# EAGLE design interface-2-cart (EAGLE 9.4.2)
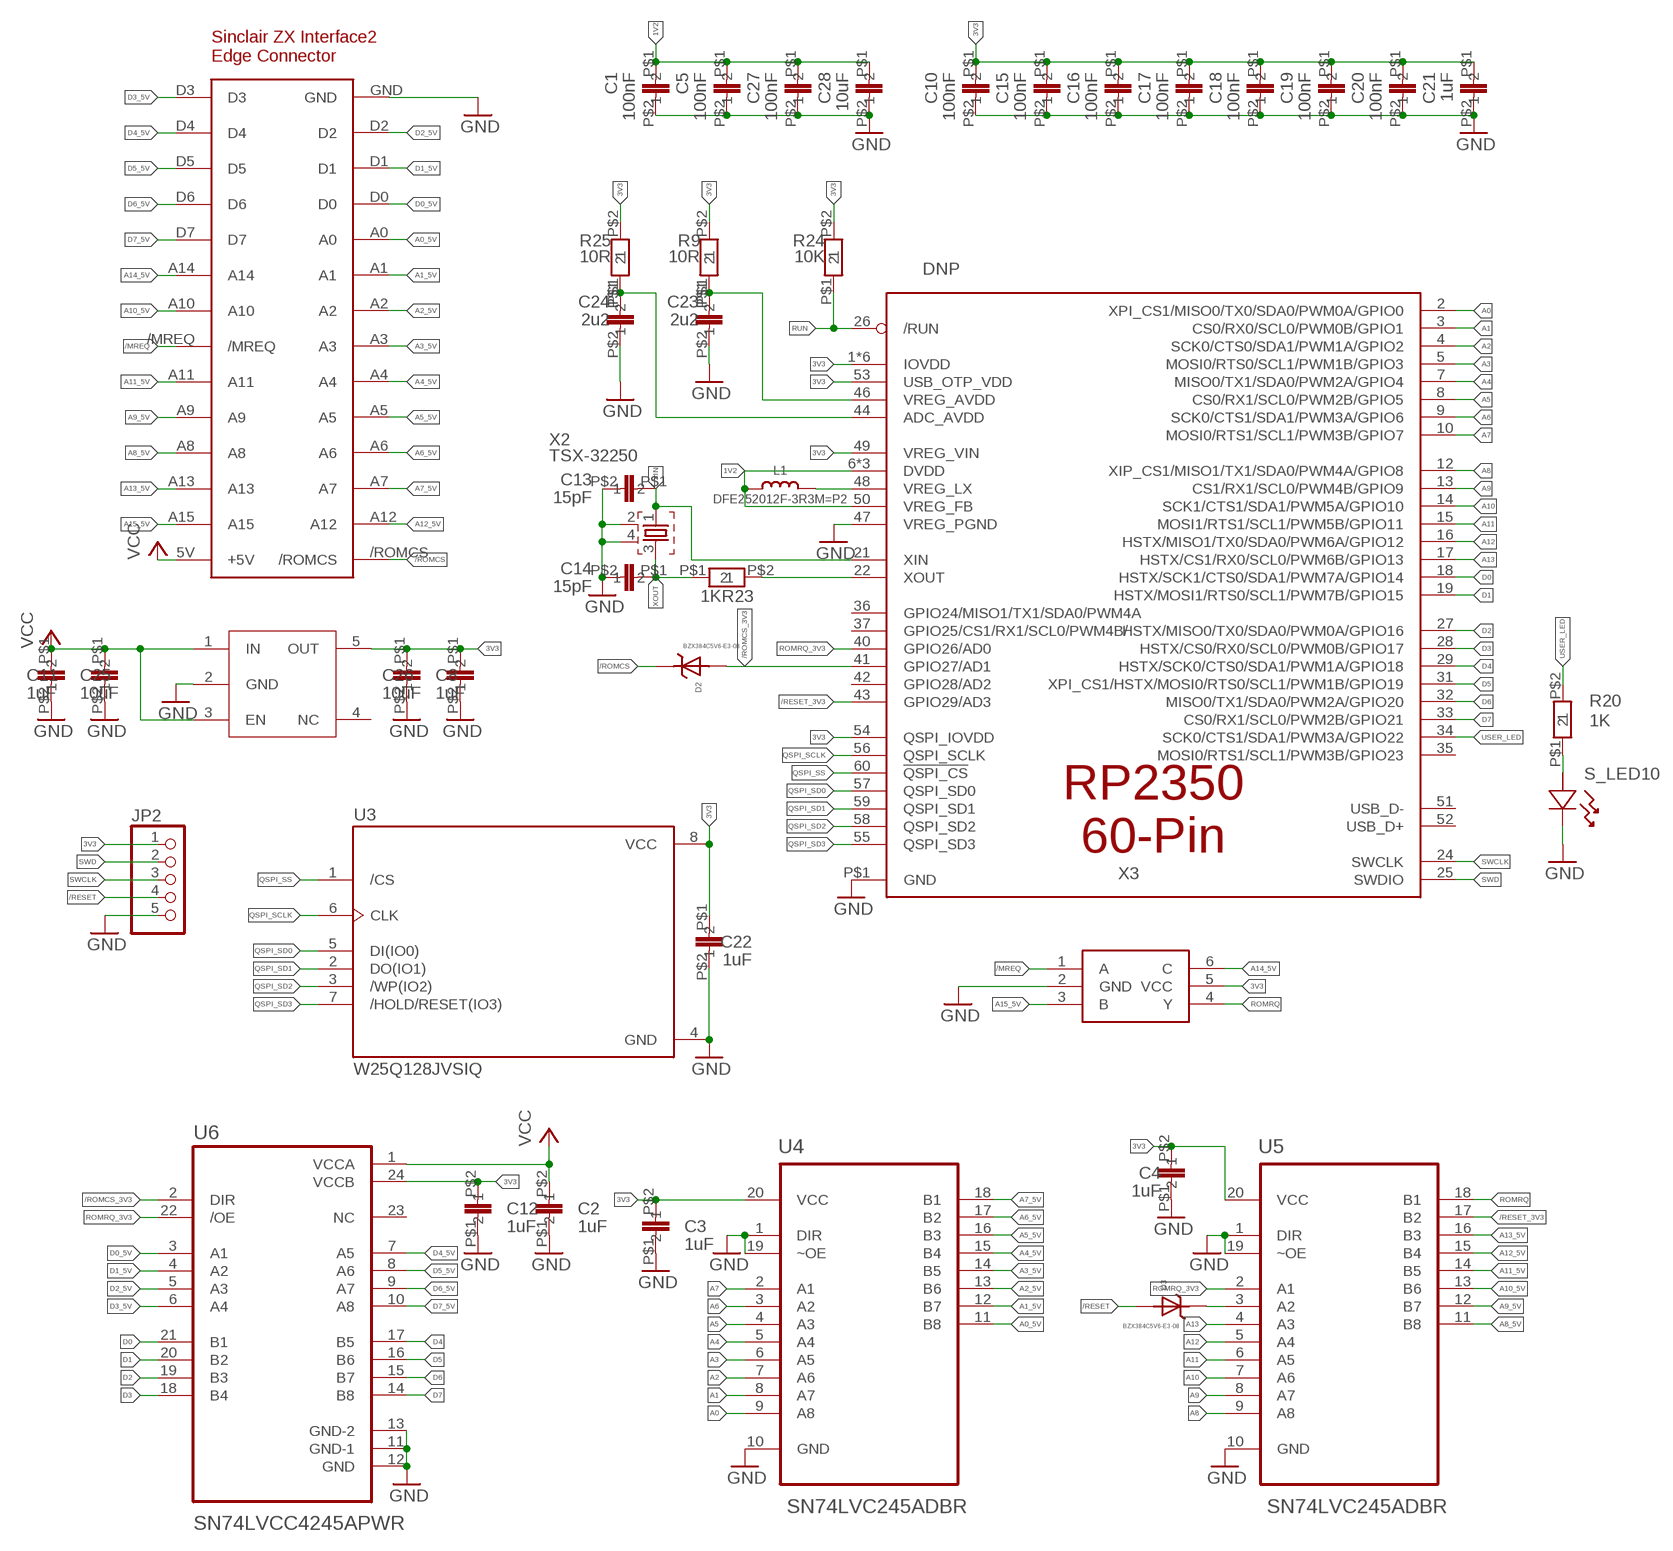
[diagram p0: schematic, sheet 1]

## Parts
3V3_REG2  3V3  NCP718BSN330T1G  [NCP718BSN330T1G]
C1  100nF  CAP-0402  [C0402]
C2  1uF  CAP-0402  [C0402]
C3  1uF  CAP-0402  [C0402]
C4  1uF  CAP-0402  [C0402]
C5  100nF  CAP-0402  [C0402]
C8  1uF  CAP-0402  [C0402]
C10  100nF  CAP-0402  [C0402]
C11  1uF  CAP-0402  [C0402]
C12  1uF  CAP-0402  [C0402]
C13  15pF  CAP-0402  [C0402]
C14  15pF  CAP-0402  [C0402]
C15  100nF  CAP-0402  [C0402]
C16  100nF  CAP-0402  [C0402]
C17  100nF  CAP-0402  [C0402]
C18  100nF  CAP-0402  [C0402]
C19  100nF  CAP-0402  [C0402]
C20  100nF  CAP-0402  [C0402]
C21  1uF  CAP-0402  [C0402]
C22  1uF  CAP-0402  [C0402]
C23  2u2  CAP-0402  [C0402]
C24  2u2  CAP-0402  [C0402]
C25  10uF  CAP-0402  [C0402]
C26  10uF  CAP-0402  [C0402]
C27  100nF  CAP-0402  [C0402]
C28  10uF  CAP-0402  [C0402]
D2  BZX384C5V6-E3-08  [SOD-323]
D3  BZX384C5V6-E3-08  [SOD-323]
JP2  PINHD-1X5  [1X05]
L1  DFE252012F-3R3M=P2  INDUCTOR  [INDUCTOR_1007]
R9  10R  RES-0402  [0402]
R20  1K  RES-0402  [0402]
R23  1K  RES-0402  [0402]
R24  10K  RES-0402  [0402]
R25  10R  RES-0402  [0402]
S_LED10  20mA  VLMW1500-GS08  [LED_VLMW15_VIS]
U3  W25Q128JVSIQ  [SOIC127P790X216-8N]
U4  SN74LVC245ADBR  [SOP65P780X200-20N]
U5  SN74LVC245ADBR  [SOP65P780X200-20N]
U6  SN74LVCC4245APWR  [SOP65P640X120-24N]
U$1  ZX_I2_ROM_EDGE_CONNECTOR  [ZX_I2_ROM_EDGE_CONNECTOR_V2]
U$2  74LVC1G332GW,125  [SOP65P210X110-6N]
X2  TSX-32250  [TSX-3225]
X3  DNP  RP2350_QFN60  [QFN60_7MM_REDUCEDEPAD]

## Nets
1V2: C1.P$1 C5.P$1 C27.P$1 C28.P$1 L1.P$1 X3.6(DVDD) X3.23(DVDD) X3.39(DVDD) X3.50(VREG_FB)
3V3: 3V3_REG2.5(OUT) C3.P$2 C4.P$2 C8.P$1 C10.P$1 C12.P$2 C15.P$1 C16.P$1 C17.P$1 C18.P$1 C19.P$1 C20.P$1 C21.P$1 C22.P$1 C26.P$1 JP2.1 R9.P$2 R24.P$2 R25.P$2 U3.8(VCC) U4.20(VCC) U5.20(VCC) U6.24(VCCB) U$2.5(VCC) X3.1(IOVDD) X3.11(IOVDD) X3.20(IOVDD) X3.30(IOVDD) X3.38(IOVDD) X3.45(IOVDD) X3.49(VREG_VIN) X3.53(USB_OTP_VDD) X3.54(QSPI_IOVDD)
/MREQ: U$1./MREQ U$2.1(A)
/RESET: D3.A JP2.4
/RESET_3V3: U5.17(B2) X3.43(GPIO29/AD3)
/ROMCS: D2.C U$1./ROMCS
/ROMCS_3V3: D2.A U6.2(DIR) X3.41(GPIO27/AD1)
A0: U4.9(A8) X3.2(XPI_CS1/MISO0/TX0/SDA0/PWM0A/GPIO0)
A0_5V: U4.11(B8) U$1.A0
A1: U4.8(A7) X3.3(CS0/RX0/SCL0/PWM0B/GPIO1)
A1_5V: U4.12(B7) U$1.A1
A2: U4.7(A6) X3.4(SCK0/CTS0/SDA1/PWM1A/GPIO2)
A2_5V: U4.13(B6) U$1.A2
A3: U4.6(A5) X3.5(MOSI0/RTS0/SCL1/PWM1B/GPIO3)
A3_5V: U4.14(B5) U$1.A3
A4: U4.5(A4) X3.7(MISO0/TX1/SDA0/PWM2A/GPIO4)
A4_5V: U4.15(B4) U$1.A4
A5: U4.4(A3) X3.8(CS0/RX1/SCL0/PWM2B/GPIO5)
A5_5V: U4.16(B3) U$1.A5
A6: U4.3(A2) X3.9(SCK0/CTS1/SDA1/PWM3A/GPIO6)
A6_5V: U4.17(B2) U$1.A6
A7: U4.2(A1) X3.10(MOSI0/RTS1/SCL1/PWM3B/GPIO7)
A7_5V: U4.18(B1) U$1.A7
A8: U5.9(A8) X3.12(XIP_CS1/MISO1/TX1/SDA0/PWM4A/GPIO8)
A8_5V: U5.11(B8) U$1.A8
A9: U5.8(A7) X3.13(CS1/RX1/SCL0/PWM4B/GPIO9)
A9_5V: U5.12(B7) U$1.A9
A10: U5.7(A6) X3.14(SCK1/CTS1/SDA1/PWM5A/GPIO10)
A10_5V: U5.13(B6) U$1.A10
A11: U5.6(A5) X3.15(MOSI1/RTS1/SCL1/PWM5B/GPIO11)
A11_5V: U5.14(B5) U$1.A11
A12: U5.5(A4) X3.16(HSTX/MISO1/TX0/SDA0/PWM6A/GPIO12)
A12_5V: U5.15(B4) U$1.A12
A13: U5.4(A3) X3.17(HSTX/CS1/RX0/SCL0/PWM6B/GPIO13)
A13_5V: U5.16(B3) U$1.A13
A14_5V: U$1.A14 U$2.6(C)
A15_5V: U$1.A15 U$2.3(B)
D0: U6.21(B1) X3.18(HSTX/SCK1/CTS0/SDA1/PWM7A/GPIO14)
D0_5V: U6.3(A1) U$1.D0
D1: U6.20(B2) X3.19(HSTX/MOSI1/RTS0/SCL1/PWM7B/GPIO15)
D1_5V: U6.4(A2) U$1.D1
D2: U6.19(B3) X3.27(HSTX/MISO0/TX0/SDA0/PWM0A/GPIO16)
D2_5V: U6.5(A3) U$1.D2
D3: U6.18(B4) X3.28(HSTX/CS0/RX0/SCL0/PWM0B/GPIO17)
D3_5V: U6.6(A4) U$1.D3
D4: U6.17(B5) X3.29(HSTX/SCK0/CTS0/SDA1/PWM1A/GPIO18)
D4_5V: U6.7(A5) U$1.D4
D5: U6.16(B6) X3.31(XPI_CS1/HSTX/MOSI0/RTS0/SCL1/PWM1B/GPIO19)
D5_5V: U6.8(A6) U$1.D5
D6: U6.15(B7) X3.32(MISO0/TX1/SDA0/PWM2A/GPIO20)
D6_5V: U6.9(A7) U$1.D6
D7: U6.14(B8) X3.33(CS0/RX1/SCL0/PWM2B/GPIO21)
D7_5V: U6.10(A8) U$1.D7
GND: 3V3_REG2.2(GND) C1.P$2 C2.P$1 C3.P$1 C4.P$1 C5.P$2 C8.P$2 C10.P$2 C11.P$2 C12.P$1 C13.P$2 C14.P$2 C15.P$2 C16.P$2 C17.P$2 C18.P$2 C19.P$2 C20.P$2 C21.P$2 C22.P$2 C23.P$2 C24.P$2 C25.P$2 C26.P$2 C27.P$2 C28.P$2 JP2.5 S_LED10.C U3.4(GND) U4.1(DIR) U4.10(GND) U4.19(~OE) U5.1(DIR) U5.10(GND) U5.19(~OE) U6.11(GND-1) U6.12(GND) U6.13(GND-2) U$1.GND U$2.2(GND) X2.2 X2.4 X3.47(VREG_PGND) X3.P$1(GND)
N$6: R20.P$1 S_LED10.A
N$9: D3.C U5.3(A2)
N$10: R23.P$2 X3.22(XOUT)
N$11: L1.P$2 X3.48(VREG_LX)
N$12: C23.P$1 R9.P$1 X3.46(VREG_AVDD)
N$13: C24.P$1 R25.P$1 X3.44(ADC_AVDD)
QSPI_SCLK: U3.6(CLK) X3.56(QSPI_SCLK)
QSPI_SD0: U3.5(DI(IO0)) X3.57(QSPI_SD0)
QSPI_SD1: U3.2(DO(IO1)) X3.59(QSPI_SD1)
QSPI_SD2: U3.3(/WP(IO2)) X3.58(QSPI_SD2)
QSPI_SD3: U3.7(/HOLD/RESET(IO3)) X3.55(QSPI_SD3)
QSPI_SS: U3.1(/CS) X3.60(!QSPI_CS)
ROMRQ: U5.18(B1) U$2.4(Y)
ROMRQ_3V3: U5.2(A1) U6.22(/OE) X3.40(GPIO26/AD0)
RUN: R24.P$1 X3.26(/RUN)
SWCLK: JP2.3 X3.24(SWCLK)
SWD: JP2.2 X3.25(SWDIO)
USER_LED: R20.P$2 X3.34(SCK0/CTS1/SDA1/PWM3A/GPIO22)
VCC: 3V3_REG2.1(IN) 3V3_REG2.3(EN) C2.P$2 C11.P$1 C25.P$1 U6.1(VCCA) U$1.5V(+5V)
XIN: C13.P$1 X2.1 X3.21(XIN)
XOUT: C14.P$1 R23.P$1 X2.3
Unconnected: 3V3_REG2.4(NC) U6.23(NC) X3.35(MOSI0/RTS1/SCL1/PWM3B/GPIO23) X3.36(GPIO24/MISO1/TX1/SDA0/PWM4A) X3.37(GPIO25/CS1/RX1/SCL0/PWM4B/) X3.42(GPIO28/AD2) X3.51(USB_D-) X3.52(USB_D+)

## Library data of the parts
3V3_REG2 = IC-packages_BIG-pack V1.0:NCP718BSN330T1G
C1-C5 C8 C10-C28 = res-small-footprint:CAP-0402
D2 D3 = BZX384C5V6-E3-08:BZX384C5V6-E3-08: VISHAY - Zener Single Diode, 5.6 V, 200 mW, SOD-323, 5 %, 2 Pins, 150 °C - SOD-323 Check availability <https://pricing.snapeda.com/parts/BZX384C5V6-E3-08/Vishay%20Semiconductors/view-part?ref=eda>; AVAILABILITY: In Stock; DESCRIPTION: Zener Diode Single 5.6V 5% 40Ohm 200mW 2-Pin SOD-323 T/R; MF: Vishay Semiconductors; MP: BZX384C5V6-E3-08; PACKAGE: None; PRICE: None; PURCHASE-URL: https://pricing.snapeda.com/search/part/BZX384C5V6-E3-08/?ref=eda
JP2 = pinhead:PINHD-1X5: PIN HEADER
L1 = microbuilder:INDUCTOR: Inductors 0603: 10nH Ceramic Inductor - microwire antenna/RF (Digikey: 712-1434-2-ND) 0805: 560nH Ceramic Inductor - RF (Digikey: 553-1047-1-ND) 270nH Ceramic Inductor - Q = 40@250MHz, +-5%, 1 Ohm DC Resistance (Digikey: 535-10506-2-ND) 1007 (2518 Metric) SMT: 10µH 10% 250mOhm 820mA 1007 Inductor (Digikey: 587-2189-1-ND) 22µH 10% 500mOhm 580mA 1007 Inductor (Digikey: 587-2190-1-ND) 47µH 10% 950mOhm 420mA 1007 Inductor (Digikey: 587-2191-1-ND) 47µH 5% 100mOhm 1A 1008 Inductor (Digikey: 732-1816-1-ND) 5.0x5.0mm (Taiyo Yuden NR5040 Series) 6.8µH 20% 2.3A 64mOhm Inductor (Digikey: 587-2374-2-ND) 5.0x5.0mm (TDK VLC5045 Series) 4.7µH 20% 3.3A 34mOhm Inductor (Digikey: 445-6526-1-ND) 6.8µH 20% 2.7A 46mOhm Inductor (Digikey: 445-6527-1-ND) 6.0x6.0mm (TDK VLC6045 Series) 4.7µH 20% 3.8A 27mOhm Inductor (Digikey: 445-6538-2-ND) 6.8µH 20% 3A 41mOhm Inductor (Digikey: 445-6540-1-ND) 6.2µH 30% 2.2A 45mOhm Inductor (Digikey: SRR5028-6R2YCT-ND) - Not TDK VLC6045 but footprint should match 6.0x6.0mm (TDK SLF6045 Series) 6.8uH 30% 2A 33mOhm Inductor (Digikey: 445-4572-1-ND, Mouser: 810-SLF645T6R8N2R0PF) 6.0x6.0mm (Sumida CDRH5D28 Series) 6.2uH 30% 1.8A 45mOhm Inductor (Digikey: 308-1542-1-ND) Taiyo Yuden NR3015T2R2M - 2.2uH 20% 1.5A (Digikey: 587-1648-2-ND, Mouser: 963-NR3015T2R2M) - Used with TI TPS62172 CoilCraft RFID Transponder Coil - MA5532-AE (For use with AS3935 Lightning Sensor) Taiyo Yuden NRH2412T2R2MNGH - 2.2uH 20% 1AA (Digikey: 587-3443-1-ND) - Used with TI LM3671 Vishay IHLP 1.0uH Molded Inductor - 24mOhm DCR, 5A, +/-20%, -55°C-125°C (Digikey: 541-1319-1-ND)
R9 R20 R23-R25 = res-small-footprint:RES-0402
S_LED10 = led-0402:VLMW1500-GS08; COPYRIGHT: Copyright (C) 2022 Ultra Librarian. All rights reserved.; MANUFACTURER_PART_NUMBER: VLMW1500-GS08; MFR_NAME: Vishay
U3 = W25Q128JVSIQ:W25Q128JVSIQ: Check availability <https://pricing.snapeda.com/parts/W25Q128JVSIQ/Winbond%20Electronics/view-part?ref=eda>; AVAILABILITY: In Stock; CHECK_PRICES: https://www.snapeda.com/parts/W25Q128JVSIQ/Winbond+Electronics/view-part/?ref=eda; DESCRIPTION: FLASH - NOR Memory IC 128Mb (16M x 8) SPI - Quad I/O, QPI, DTR 133 MHz 8-SOIC; MF: Winbond Electronics; MP: W25Q128JVSIQ; PACKAGE: SOIC-8 Winbond Electronics; PRICE: None; PURCHASE-URL: https://www.snapeda.com/api/url_track_click_mouser/?unipart_id=1054022&manufacturer=Winbond Electronics&part_name=W25Q128JVSIQ&search_term=None; SNAPEDA_LINK: https://www.snapeda.com/parts/W25Q128JVSIQ/Winbond+Electronics/view-part/?ref=snap
U4 U5 = SN74LVC245ADBR:SN74LVC245ADBR: Check availability <https://pricing.snapeda.com/parts/SN74LVC245ADBR/Texas%20Instruments/view-part?ref=eda>; AVAILABILITY: In Stock; CHECK_PRICES: https://www.snapeda.com/parts/SN74LVC245ADBR/Texas+Instruments/view-part/?ref=eda; DESCRIPTION: Octal Bus Transceiver With 3-State Outputs; MF: Texas Instruments; MP: SN74LVC245ADBR; PACKAGE: SSOP-20 Texas Instruments; PRICE: None; SNAPEDA_LINK: https://www.snapeda.com/parts/SN74LVC245ADBR/Texas+Instruments/view-part/?ref=snap
U6 = SN74LVCC4245APWR:SN74LVCC4245APWR: Check availability <https://pricing.snapeda.com/parts/SN74LVCC4245APWR/Texas%20Instruments/view-part?ref=eda>; AVAILABILITY: In Stock; CHECK_PRICES: https://www.snapeda.com/parts/SN74LVCC4245APWR/Texas+Instruments/view-part/?ref=eda; DESCRIPTION: Octal Bus Transceiver With Adjustable Output Voltage and 3-State Outputs; MF: Texas Instruments; MP: SN74LVCC4245APWR; PACKAGE: TSSOP-24 Texas Instruments; PRICE: None; SNAPEDA_LINK: https://www.snapeda.com/parts/SN74LVCC4245APWR/Texas+Instruments/view-part/?ref=snap
U$1 = zxs_i2_rom_edge_connector:ZX_I2_ROM_EDGE_CONNECTOR: Edge connector pro ROM modul pro Interface 2 počítače ZX Spectrum
U$2 = 74LVC1G332GW_125:74LVC1G332GW,125
X2 = TSX-3225:TSX-3225: MHz RANGE CRYSTAL UNIT Source: Epson Toyocom Check availability <https://pricing.snapeda.com/parts/TSX-3225/EPSON/view-part?ref=eda>; AVAILABILITY: Not in stock; DESCRIPTION: 38.4MHz ±10ppm Crystal 8.5pF 40 Ohms 4-SMD, No Lead; MF: EPSON; MP: TSX-3225; PACKAGE: SMD-4 EPSON; PRICE: None
X3 = adafruit_micro:RP2350

## Board
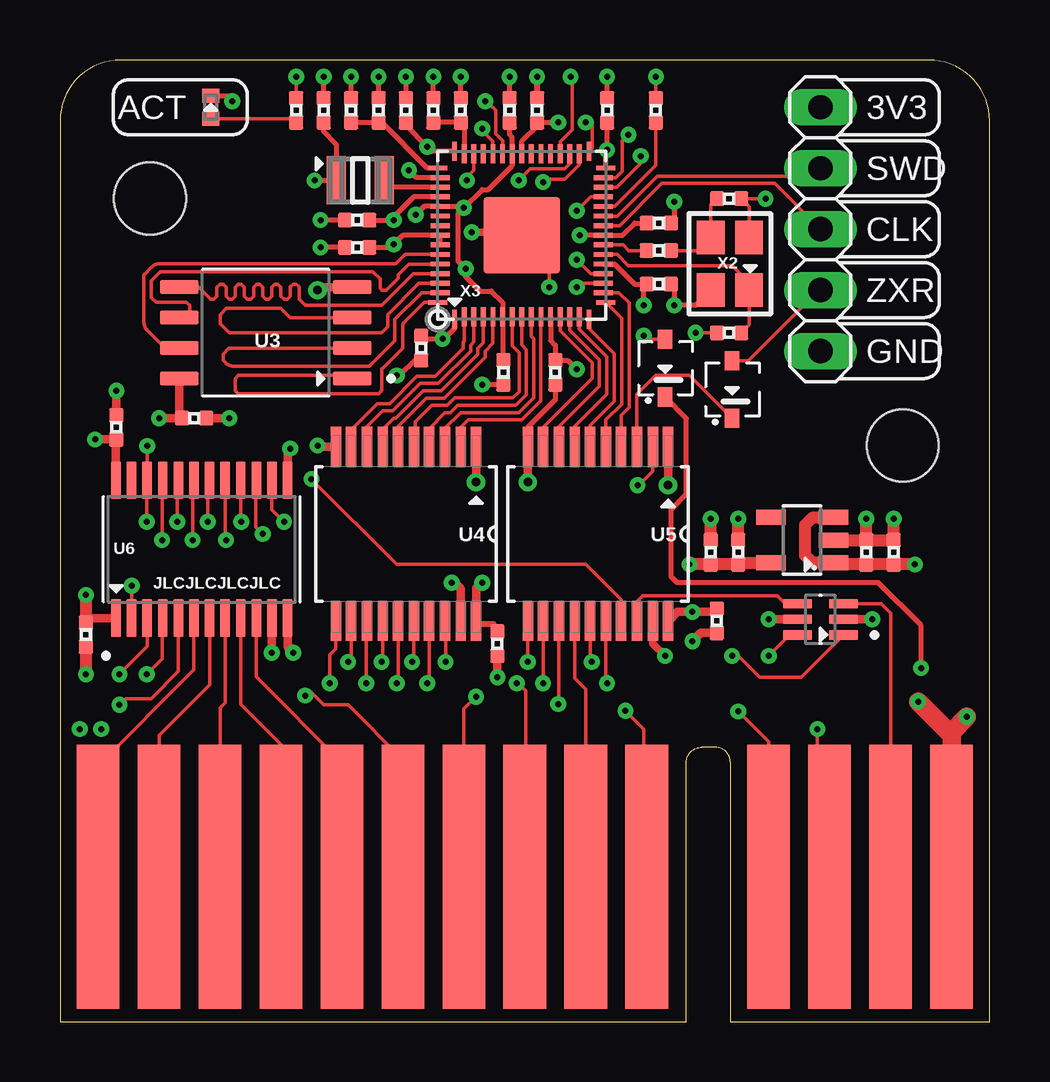
[diagram p1: board, top side]
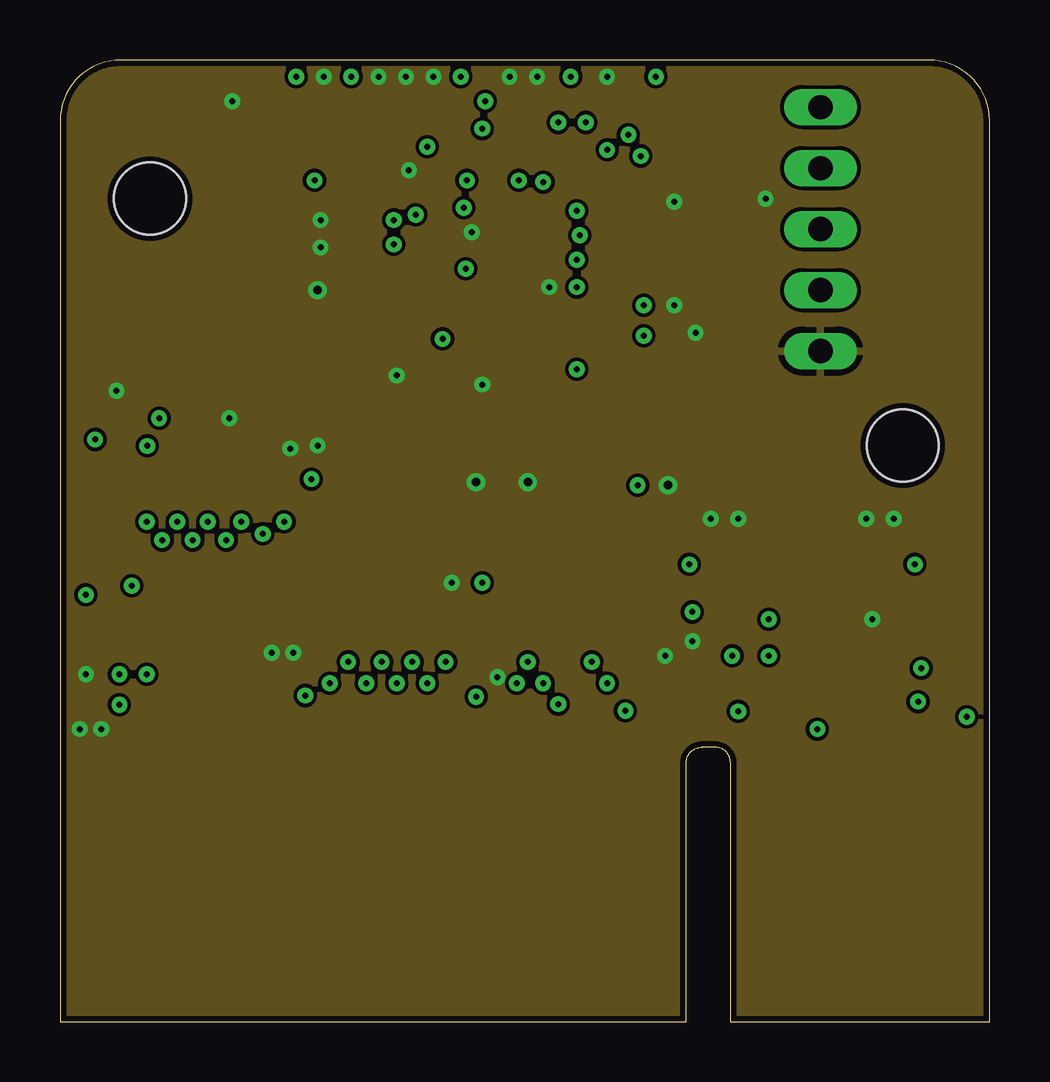
[diagram p2: board, inner layer Route2]
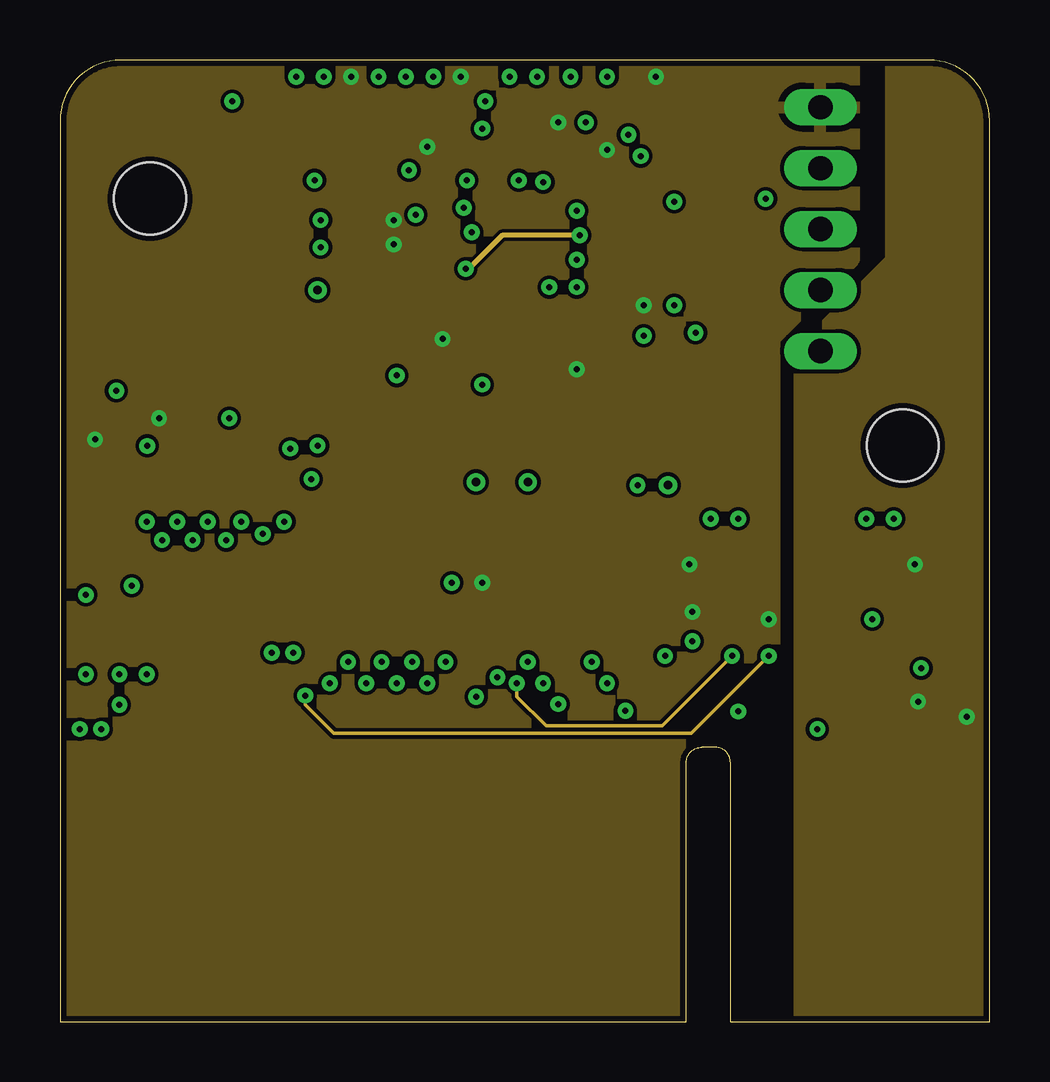
[diagram p3: board, inner layer Route15]
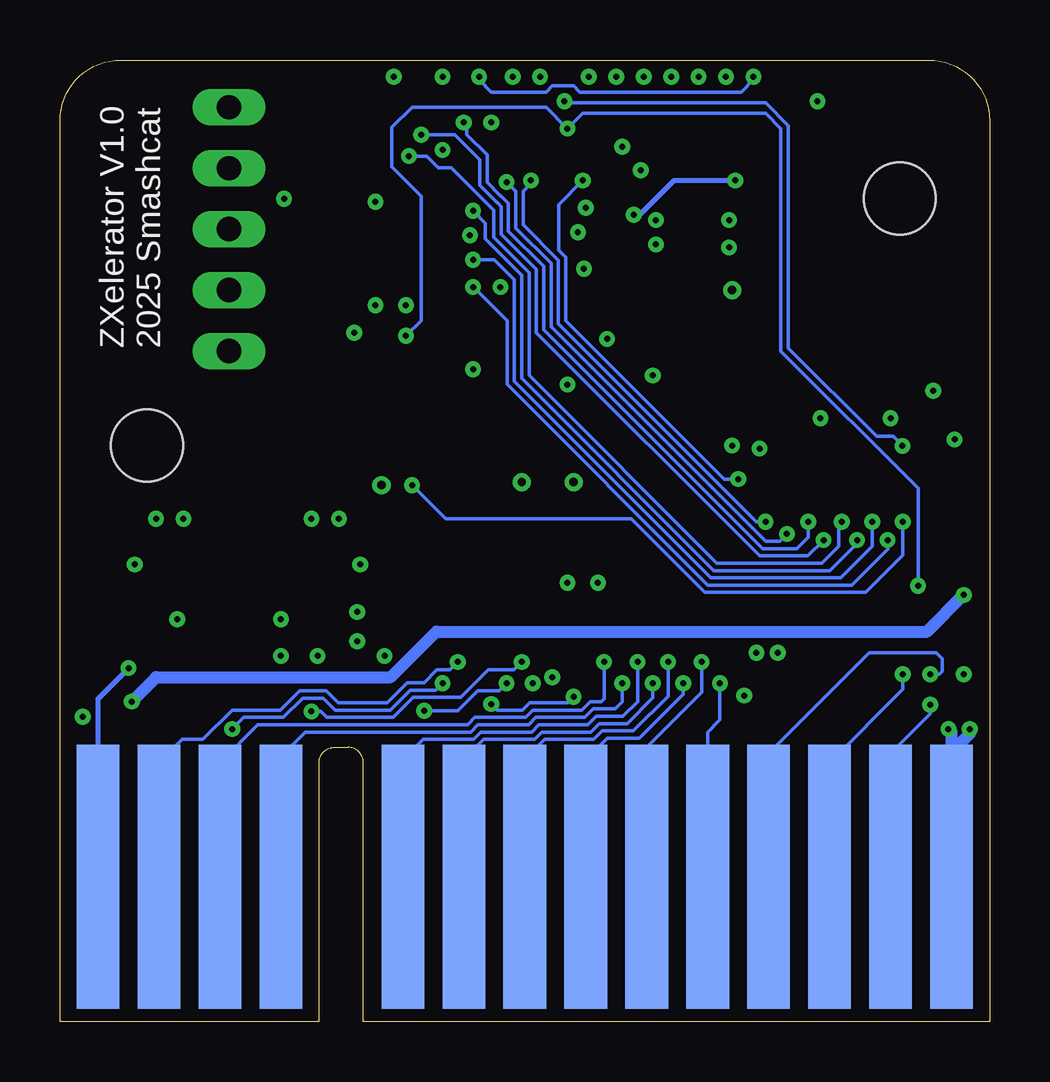
[diagram p4: board, bottom side, seen from below]

Size 38.73 x 40.07 mm. Coordinates in mm from the lower left corner, seen from the top.
Outline: 0,0 26.1,0 26.1,10.79 arc-90 26.73,11.43 27.3,11.43 arc-90 27.94,10.79 27.94,0 38.73,0 38.73,37.53 arc90 36.2,40.07 2.54,40.07 arc90 0,37.53 0,0
Copper layers (1+2*15+16): Top 0.035mm / dielectric 0.1mm / Route2 0.0175mm / dielectric 1.265mm / Route15 0.0175mm / dielectric 0.1mm / Bottom 0.035mm
Design rules "moje_1 *": minimum track width 6mil, minimum drill 0.2mm, track to track 6mil, track to pad 6mil, pad to pad 6mil, via to via 6mil, smd to smd 6mil, copper to edge 10mil, drill to drill 6mil, minimum pad ring 10mil, minimum via ring 8mil, stop-mask expansion 4mil, vias tented up to drill 0mil, thermal gap 10mil
Holes 3 mm at 3.75,34.29 35.12,24

### Footprints (pad centres in the part's own frame; a part is rotated, then mirrored left to right if it is on the bottom)
NCP718BSN330T1G = smd 0.62 x 1.22: 1 -0.95,-1.3; 2 0,-1.3; 3 0.95,-1.3; 4 0.95,1.3; 5 -0.95,1.3
C0402 = smd 0.6 x 0.6: P$1 -0.5,0; P$2 0.5,0
SOD-323 = smd 0.8 x 0.6: A 1.25,0; C -1.15,0
1X05 = drill 1.016 long: 1 -5.08,0; 2 -2.54,0; 3 0,0; 4 2.54,0; 5 5.08,0
INDUCTOR_1007 = smd 0.8 x 2: P$1 -1,0; P$2 1,0
0402 = smd 0.6 x 0.6: P$1 -0.5,0; P$2 0.5,0
LED_VLMW15_VIS = smd 0.597 x 0.711: A 0.476,0; C -0.476,0
SOIC127P790X216-8N = smd 1.61 x 0.58: 1 -3.605,1.905; 2 -3.605,0.635; 3 -3.605,-0.635; 4 -3.605,-1.905; 5 3.605,-1.905; 6 3.605,-0.635; 7 3.605,0.635; 8 3.605,1.905
SOP65P780X200-20N = smd 1.651 x 0.432: 1 -3.632,2.921; 2 -3.632,2.286; 3 -3.632,1.626; 4 -3.632,0.965; 5 -3.632,0.33; 6 -3.632,-0.33; 7 -3.632,-0.965; 8 -3.632,-1.626; 9 -3.632,-2.286; 10 -3.632,-2.921; 11 3.632,-2.921; 12 3.632,-2.286; 13 3.632,-1.626; 14 3.632,-0.965; 15 3.632,-0.33; 16 3.632,0.33; 17 3.632,0.965; 18 3.632,1.626; 19 3.632,2.286; 20 3.632,2.921
SOP65P640X120-24N = smd 1.57 x 0.41: 1 -2.87,3.575; 2 -2.87,2.925; 3 -2.87,2.275; 4 -2.87,1.625; 5 -2.87,0.975; 6 -2.87,0.325; 7 -2.87,-0.325; 8 -2.87,-0.975; 9 -2.87,-1.625; 10 -2.87,-2.275; 11 -2.87,-2.925; 12 -2.87,-3.575; 13 2.87,-3.575; 14 2.87,-2.925; 15 2.87,-2.275; 16 2.87,-1.625; 17 2.87,-0.975; 18 2.87,-0.325; 19 2.87,0.325; 20 2.87,0.975; 21 2.87,1.625; 22 2.87,2.275; 23 2.87,2.925; 24 2.87,3.575
ZX_I2_ROM_EDGE_CONNECTOR_V2 = smd 1.778 x 11: 5V 10.16,5.08; /MREQ -7.62,5.08; A8 2.54,5.08; A9 -2.54,5.08; A10 -10.16,5.08; A11 -5.08,5.08; A13 5.08,5.08; A14 -12.7,5.08; A15 7.62,5.08; D3 -25.4,5.08; D4 -22.86,5.08; D5 -20.32,5.08; D6 -17.78,5.08; D7 -15.24,5.08 | smd 1.778 x 11 bottom: /ROMCS 10.16,5.08; A0 -15.24,5.08; A1 -12.7,5.08; A2 -10.16,5.08; A3 -7.62,5.08; A4 -5.08,5.08; A5 -2.54,5.08; A6 2.54,5.08; A7 5.08,5.08; A12 7.62,5.08; D0 -17.78,5.08; D1 -20.32,5.08; D2 -22.86,5.08; GND -25.4,5.08
SOP65P210X110-6N = smd 1.19 x 0.4: 1 -0.96,0.65; 2 -0.96,0; 3 -0.96,-0.65; 4 0.96,-0.65; 5 0.96,0; 6 0.96,0.65
TSX-3225 = smd 1.4 x 1.15: 1 0,-1.6; 2 2.2,-1.6; 3 2.2,0; 4 0,0
QFN60_7MM_REDUCEDEPAD = smd 0.8 x 0.2: 1 -3.5,2.8; 2 -3.4,2.4; 3 -3.4,2; 4 -3.4,1.6; 5 -3.4,1.2; 6 -3.4,0.8; 7 -3.4,0.4; 8 -3.4,0; 9 -3.4,-0.4; 10 -3.4,-0.8; 11 -3.4,-1.2; 12 -3.4,-1.6; 13 -3.4,-2; 14 -3.4,-2.4; 15 -3.5,-2.8; 31 3.5,-2.8; 32 3.4,-2.4; 33 3.4,-2; 34 3.4,-1.6; 35 3.4,-1.2; 36 3.4,-0.8; 37 3.4,-0.4; 38 3.4,0; 39 3.4,0.4; 40 3.4,0.8; 41 3.4,1.2; 42 3.4,1.6; 43 3.4,2; 44 3.4,2.4; 45 3.5,2.8 | smd 0.2 x 0.8: 16 -2.8,-3.5; 17 -2.4,-3.4; 18 -2,-3.4; 19 -1.6,-3.4; 20 -1.2,-3.4; 21 -0.8,-3.4; 22 -0.4,-3.4; 23 0,-3.4; 24 0.4,-3.4; 25 0.8,-3.4; 26 1.2,-3.4; 27 1.6,-3.4; 28 2,-3.4; 29 2.4,-3.4; 30 2.8,-3.5; 46 2.8,3.5; 47 2.4,3.4; 48 2,3.4; 49 1.6,3.4; 50 1.2,3.4; 51 0.8,3.4; 52 0.4,3.4; 53 0,3.4; 54 -0.4,3.4; 55 -0.8,3.4; 56 -1.2,3.4; 57 -1.6,3.4; 58 -2,3.4; 59 -2.4,3.4; 60 -2.8,3.5 | smd 3.2 x 3.2: P$1 0,0

### Placement (x,y rotation side)
3V3_REG2  30.92,20.07 90 top
C1  24.96,33.27 0 top
C2  1.08,16.13 90 top
C3  19.88,37.97 270 top
C4  18.22,15.75 90 top
C5  18.73,37.97 90 top
C8  28.26,19.56 90 top
C10  12.38,33.4 180 top
C11  33.59,19.56 90 top
C12  2.35,24.77 270 top
C13  27.88,28.7 180 top
C14  27.88,34.29 0 top
C15  24.96,30.73 0 top
C16  20.64,27.05 270 top
C17  27.37,16.7 270 top
C18  5.59,25.15 0 top
C19  15.05,28.07 270 top
C20  14.41,37.97 90 top
C21  12.38,32.26 180 top
C22  22.8,37.97 90 top
C23  13.27,37.97 90 top
C24  15.56,37.97 90 top
C25  34.73,19.56 90 top
C26  27.11,19.56 90 top
C27  18.48,27.05 270 top
C28  10.99,37.97 90 top
D2  25.21,27.18 90 top
D3  28,26.29 90 top
JP2  31.69,33.02 270 top
L1  12.51,35.05 0 top
R9  12.13,37.97 90 top
R20  9.84,37.97 90 top
R23  24.96,32.13 180 top
R24  24.83,37.97 90 top
R25  16.7,37.97 90 top
S_LED10  6.29,38.1 270 top
U3  8.57,28.7 180 top
U4  14.41,20.32 270 top
U5  22.42,20.32 270 top
U6  5.91,19.68 90 top
U$1  26.99,0.95 0 top
U$2  31.69,16.76 180 top
X2  27.11,30.48 90 top
X3  19.24,32.77 90 top

### Tracks (layer width: path | path; a pad name or v marks a point on that pad's centre or on a via)
1V2  (via drill 0.25)
  Top 0.203: v14.83,33.62 15.17,33.97 X3.50 16.77,33.97 v16.83,33.91 | v10.6,35.05 L1.P$1 11.51,36.57 10.99,37.09 C28.P$1 | C1.P$1 23.94,33.27 23.43,32.77 X3.23 v21.65,32.77 | C5.P$1 18.73,36.97 18.84,36.86 X3.39 18.84,35.67 17.84,34.67 17.59,34.67 v16.83,33.91 | C27.P$1 18.44,27.59 X3.6 18.44,29.97 17.97,30.44 17.5,30.44 16.9,31.04 v16.9,31.37 16.57,31.7 16.57,33.66 v16.83,33.91
  Route15 0.203: v16.9,31.37 17.03,31.37 18.43,32.77 v21.65,32.77
  Bottom 0.203: v14.83,33.62 14.57,33.62 13.14,35.05 v10.6,35.05
3V3  (via drill 0.25)
  Top 0.152: R24.P$2 v24.83,39.37
  Top 0.203: X3.49 14.74,34.37 13.91,33.53 v13.91,33.4 C10.P$1 | C21.P$1 13.77,32.26 13.9,32.38 v13.91,32.38 14.29,32.77 X3.53 X3.54 | X3.30 22.74,36.27 v22.8,36.32 C22.P$1 | X3.38 19.24,36.7 19.88,37.34 C3.P$2 v20.76,37.47 v20.77,37.47 | R9.P$2 v12.13,39.37 | X3.45 15.49,36.27 v15.3,36.45 v15.3,36.46 14.42,37.34 C20.P$1 | R25.P$2 v16.7,39.37 | X3.11 20.44,28.38 20.64,28.19 C16.P$1 21.15,27.55 v21.53,27.18 | X3.1 16.44,28.89 16,28.45 v15.94,28.45 15.17,28.45 C19.P$1 | X3.20 23.11,31.57 23.94,30.73 C15.P$1 24.45,30.73 24.32,30.61 v24.32,29.84
  Top 0.254: C4.P$2 18.06,16.56 17.46,16.56 U4.20
  Top 0.356: U$2.5 v29.53,16.76 | U4.20 17.34,18.09 17.54,18.29 v17.59,18.29 | U5.20 25.72,17.07 v26.35,17.07 27.09,17.07 C17.P$1 | v4.13,25.15 C18.P$1 4.97,25.27 U3.8 | U6.24 2.33,24.14 C12.P$2 2.34,24.26 v1.46,24.26
  Top 0.508: 3V3_REG2.5 28.32,19.12 C8.P$1 C26.P$1 v26.23,19.05
  pour Route15: -3.17,50.8 -3.17,-2.54 29.78,-2.54 29.78,28.45 33.08,31.75 33.08,50.8
/MREQ  (via drill 0.25)
  Top 0.152: U$1./MREQ 19.42,6.08 19.42,13.79 19.11,14.1 v19.03,14.1 | v28,15.24 28.26,15.24 29.15,14.35 30.88,14.35 U$2.1
  Route15 0.152: v19.03,14.1 19.03,13.54 20.25,12.32 25.08,12.32 v28,15.24
/RESET
  Top 0.152: D3.A 28.68,27.54 31.62,30.48 JP2.4
/RESET_3V3  (via drill 0.25)
  Top 0.152: U5.17 23.38,17.58 21.91,19.05 14.03,19.05 v10.48,22.61 | v16.95,35.05 16.95,35.18 17.24,35.47 X3.43
  Bottom 0.152: v10.48,22.61 11.06,22.61 17.66,29.2 17.66,31.84 17.96,32.14 17.96,34.05 v16.95,35.05
/ROMCS  (via drill 0.25)
  Top 0.203: v35.88,14.73 35.88,16.51 34.1,18.29 25.72,18.29 25.46,18.54 25.46,21.33 26.1,21.97 26.1,25.14 D2.C
  Bottom 0.203: U$1./ROMCS 37.15,13.46 v35.88,14.73
/ROMCS_3V3  (via drill 0.25)
  Top 0.152: v2.98,18.16 U6.2 | X3.41 18.04,36.67 17.66,37.05 17.66,37.14 v17.59,37.21 | D2.A 24.47,28.43 v24.32,28.57
  Bottom 0.152: v2.98,18.16 2.98,22.23 8.7,27.94 8.7,37.21 9.34,37.85 16.95,37.85 v17.59,37.21 18.48,38.1 24.07,38.1 24.91,37.26 24.91,35.61 23.69,34.39 23.69,29.21 v24.32,28.57
A0
  Top 0.152: U4.9 12.13,24.66 13.23,25.76 13.73,25.76 14.87,26.9 15.64,26.9 16.8,28.07 16.8,28.32 16.84,28.36 X3.2
A0_5V  (via drill 0.25)
  Top 0.152: v11.24,14.1 11.24,15.29 11.49,15.54 U4.11
  Bottom 0.152: v11.24,14.1 11.24,12.57 11.75,12.06 U$1.A0
A1
  Top 0.152: U4.8 12.79,24.79 13.45,25.45 13.86,25.45 15,26.59 15.76,26.59 17.11,27.94 17.11,28.19 17.24,28.33 X3.3
A1_5V  (via drill 0.25)
  Top 0.152: v12,14.99 12.13,15.11 U4.12
  Bottom 0.152: v12,14.99 12,13.72 14.29,11.43 U$1.A1
A2
  Top 0.152: U4.7 13.45,24.69 13.91,25.15 13.98,25.15 15.13,26.29 15.89,26.29 17.41,27.81 17.41,28.07 17.64,28.3 X3.4
A2_5V  (via drill 0.25)
  Top 0.152: v12.76,14.1 12.76,16.66 U4.13
  Bottom 0.152: U$1.A2 16.83,10.92 15.94,11.81 14.59,11.81 12.76,13.64 v12.76,14.1
A3
  Top 0.152: U4.6 14.08,24.82 15.25,25.98 16.02,25.98 17.72,27.69 17.72,27.94 18.04,28.26 X3.5
A3_5V  (via drill 0.25)
  Top 0.152: v13.4,14.99 13.45,15.04 U4.14
  Bottom 0.152: U$1.A3 19.37,10.92 18.53,11.76 16.5,11.76 16.14,12.12 14.85,12.12 13.4,13.56 v13.4,14.99
A4
  Top 0.152: X3.7 18.84,28.16 19.13,27.88 19.13,26.24 18.87,25.99 16.45,25.99 16.14,25.68 15.49,25.68 14.81,25 14.81,24.02 U4.5
A4_5V  (via drill 0.25)
  Top 0.152: v14.03,14.1 14.08,14.15 U4.15
  Bottom 0.152: U$1.A4 21.91,10.92 21.07,11.76 18.96,11.76 18.66,12.07 16.62,12.07 16.27,12.42 15.1,12.42 14.03,13.48 v14.03,14.1
A5
  Top 0.152: U4.4 15.38,24.71 16.04,25.38 16.27,25.38 16.57,25.68 19,25.68 19.43,26.11 19.43,28 19.24,28.19 X3.8
A5_5V  (via drill 0.25)
  Top 0.152: v14.67,14.99 14.74,15.06 U4.16
  Bottom 0.152: U$1.A5 24.45,10.92 23.61,11.76 21.5,11.76 21.2,12.07 19.09,12.07 18.78,12.37 16.75,12.37 16.39,12.72 15.28,12.72 14.67,13.34 v14.67,14.99
A6
  Top 0.152: U4.3 16.04,24.72 16.7,25.38 19.12,25.38 19.74,25.99 19.74,28.46 19.64,28.56 X3.9
A6_5V  (via drill 0.25)
  Top 0.152: v15.3,14.1 15.38,14.17 U4.17
  Bottom 0.152: U$1.A6 29.53,11.05 28.51,12.07 21.63,12.07 21.32,12.37 19.21,12.37 18.91,12.68 16.88,12.68 16.52,13.03 15.61,13.03 15.3,13.34 v15.3,14.1
A7
  Top 0.152: X3.10 20.04,25.86 19.25,25.07 17.01,25.07 16.7,24.77 U4.2
A7_5V  (via drill 0.25)
  Top 0.152: v16.07,14.99 16.07,16.66 U4.18
  Bottom 0.152: U$1.A7 32.07,10.79 30.49,12.37 21.75,12.37 21.45,12.68 19.34,12.68 19.03,12.98 17,12.98 16.65,13.34 16.19,13.34 16.07,13.46 v16.07,14.99
A8
  Top 0.152: U5.9 20.13,24.77 22.17,26.81 22.17,27.45 20.84,28.78 X3.12
A8_5V  (via drill 0.25)
  Top 0.152: U$1.A8 29.53,11.66 v28.26,12.93 | v19.49,14.99 U5.11
  Bottom 0.152: v28.26,12.93 27.88,12.93 27.62,12.68 24.85,12.68 24.02,13.51 22.04,13.51 20.89,14.65 19.83,14.65 v19.49,14.99
A9
  Top 0.152: U5.8 20.79,24.79 22.48,26.48 22.48,27.57 21.24,28.81 X3.13
A9_5V  (via drill 0.25)
  Top 0.152: U$1.A9 24.32,6.16 24.32,12.19 v23.56,12.95 | v20.13,14.1 U5.12
  Bottom 0.152: v20.13,14.1 20.44,13.79 21.33,13.79 22.16,12.95 v23.56,12.95
A10
  Top 0.152: U5.7 21.45,24.82 22.78,26.15 22.78,27.7 21.64,28.84 X3.14
A10_5V  (via drill 0.25)
  Top 0.152: U$1.A10 16.83,13.03 v17.34,13.54 | v20.77,13.23 20.79,13.26 U5.13
  Bottom 0.152: v17.34,13.54 17.59,13.29 19.16,13.29 19.46,12.98 20.51,12.98 v20.77,13.23
A11
  Top 0.152: U5.6 22.09,24.84 23.1,25.86 23.1,27.82 22.04,28.89 X3.15
A11_5V
  Top 0.152: U5.14 21.45,14.3 21.91,13.84 U$1.A11
A12
  Top 0.152: X3.16 23.41,29.3 23.41,25.73 22.75,25.07 U5.5
A12_5V  (via drill 0.25)
  Top 0.152: v22.16,14.99 22.09,15.06 U5.15
  Bottom 0.152: U$1.A12 34.61,10.79 33.64,11.76 32.78,11.76 31.56,12.98 29.55,12.98 28.74,13.79 27.65,13.79 27.14,13.29 25.11,13.29 24.27,14.12 23.56,14.12 23.03,14.65 22.49,14.65 v22.16,14.99
A13
  Top 0.152: X3.17 23.29,30.37 23.71,29.95 23.71,25.61 23.38,25.27 U5.4
A13_5V  (via drill 0.25)
  Top 0.152: U$1.A13 31.56,6.54 v31.56,12.19 | v22.8,14.1 22.75,14.15 U5.16
  Bottom 0.152: v31.56,12.19 31.08,12.68 29.43,12.68 28.62,13.48 27.77,13.48 27.27,12.98 24.98,12.98 24.14,13.82 23.08,13.82 v22.8,14.1
A14_5V  (via drill 0.25)
  Top 0.152: U$1.A14 14.29,10.92 12,13.21 10.99,13.21 10.48,13.72 10.35,13.72 v10.22,13.59 | v29.53,15.24 30.4,16.11 U$2.6
  Route15 0.152: v10.22,13.59 10.22,13.21 11.41,12.02 26.3,12.02 v29.53,15.24
A15_5V
  Top 0.152: U$2.3 34.21,17.41 34.61,17.02 U$1.A15
D0  (via drill 0.25)
  Top 0.152: U6.21 4.25,22.53 v4.25,20.07 | v21.53,30.61 21.69,30.77 X3.18
  Bottom 0.152: v4.25,20.07 4.25,19.68 5.75,18.19 11.74,18.19 20.1,26.55 20.1,29.21 21.5,30.61 v21.53,30.61
D0_5V  (via drill 0.25)
  Top 0.152: v2.48,14.48 3.63,15.63 U6.3
  Bottom 0.152: U$1.D0 9.21,11.18 5.02,15.37 2.22,15.37 1.97,15.11 1.97,14.61 2.1,14.48 v2.48,14.48
D1  (via drill 0.25)
  Top 0.152: v4.89,20.83 4.89,22.51 U6.20 | v21.53,31.75 22.11,31.17 X3.19
  Bottom 0.152: v4.89,20.83 4.89,19.81 6.21,18.49 11.62,18.49 19.8,26.67 19.8,30.91 20.64,31.75 v21.53,31.75
D1_5V  (via drill 0.25)
  Top 0.152: U6.4 4.25,16.79 4.25,15.11 v3.62,14.48
  Bottom 0.152: U$1.D1 6.67,10.79 3.62,13.84 v3.62,14.48
D2  (via drill 0.25)
  Top 0.152: v5.52,20.07 5.52,22.5 U6.19 | v21.53,33.78 22.11,34.37 X3.27
  Bottom 0.152: v5.52,20.07 5.52,19.94 6.67,18.8 11.49,18.8 19.49,26.8 19.49,31.09 21.02,32.62 21.02,33.27 v21.53,33.78
D2_5V  (via drill 0.25)
  Top 0.152: U6.5 4.93,14.59 3.8,13.46 2.73,13.46 v2.48,13.21
  Bottom 0.152: U$1.D2 4.13,11.18 2.48,12.83 v2.48,13.21
D3  (via drill 0.25)
  Top 0.152: v6.16,20.83 6.16,22.48 U6.18 | v24.19,36.07 24.19,35.77 23.2,34.77 X3.28
  Bottom 0.152: v6.16,20.83 6.29,20.7 6.29,19.81 7,19.1 11.36,19.1 19.19,26.92 19.19,31.21 20.66,32.69 20.66,33.8 22.44,35.59 22.97,35.59 23.46,36.07 v24.19,36.07
D3_5V
  Top 0.152: U$1.D3 1.59,10.67 5.58,14.66 U6.6
D4  (via drill 0.25)
  Top 0.152: v6.92,20.07 6.88,20.11 U6.17 | v23.69,36.96 23.43,36.7 23.43,35.43 23.16,35.17 X3.29
  Bottom 0.152: v6.92,20.07 7.58,19.41 9.59,19.41 18.88,28.7 18.88,31.34 20.36,32.82 20.36,33.96 20.5,34.11 20.51,34.11 21.25,34.85 21.25,35.91 22.29,36.96 v23.69,36.96
D4_5V
  Top 0.152: U$1.D4 4.13,11.94 6.23,14.04 U6.7
D5  (via drill 0.25)
  Top 0.152: v7.56,20.83 7.53,20.85 U6.16 | v21.91,37.47 22.04,37.47 22.17,37.33 22.17,36.39 X3.31
  Bottom 0.152: v7.56,20.83 7.56,20.19 8.04,19.71 9.46,19.71 18.58,28.83 18.58,31.47 20.05,32.94 20.05,34.09 20.38,34.42 20.94,34.97 20.94,36.12 21.78,36.96 21.78,37.34 v21.91,37.47
D5_5V
  Top 0.152: U$1.D5 6.67,13.08 6.88,13.29 U6.8
D6  (via drill 0.25)
  Top 0.152: v8.45,20.32 8.17,20.6 8.17,22.54 U6.15 | v20.13,34.98 20.25,35.11 21.03,35.11 21.64,35.71 X3.32
  Bottom 0.152: v8.45,20.32 8.75,20.02 9.33,20.02 18.27,28.95 18.27,31.59 19.75,33.07 19.75,34.6 v20.13,34.98
D6_5V
  Top 0.152: U6.9 7.53,13.23 9.21,11.56 U$1.D6
D7  (via drill 0.25)
  Top 0.152: v9.34,20.83 8.83,21.34 U6.14 | v19.11,35.05 19.6,35.54 21.04,35.54 21.24,35.74 X3.33
  Bottom 0.152: v9.34,20.83 9.72,20.83 17.97,29.08 17.97,31.72 19.44,33.19 19.44,34.6 19.11,34.92 v19.11,35.05
D7_5V
  Top 0.152: U6.10 8.18,14.36 11.75,10.79 U$1.D7
GND  (via drill 0.25, 0.35)
  Top 0.152: X2.2 28.71,33.95 C14.P$2 v29.4,34.29 | X3.P$1 20.38,31.62 v20.38,30.61 | C13.P$2 v26.48,28.7
  Top 0.203: v14.41,39.37 C20.P$2 | C22.P$2 v22.8,39.37 | X3.47 14.85,35.17 v14.54,35.48 | C21.P$2 v10.86,32.26 | C1.P$2 25.59,33.27 v25.59,34.16 | C27.P$2 v17.59,26.54 | X2.4 26.48,29.84 v25.59,29.84 25.59,30.6 C15.P$2 | S_LED10.C 6.95,38.58 v7.18,38.35 | C19.P$2 14.8,27.57 14.15,26.92 v14.03,26.92 | C23.P$2 v13.27,39.37 | C5.P$2 v18.73,39.37 | C28.P$2 v10.99,39.37 | C24.P$2 v15.56,39.37 | C10.P$2 v10.86,33.4 | U5.10 19.49,24.77 20.64,25.91 C16.P$2
  Top 0.254: C3.P$1 v19.88,39.37 | v8.83,15.37
  Top 0.305: U5.19 24.7,15.75 v25.21,15.24 | X3.P$1 19.11,32.89 v17.16,32.89
  Top 0.356: U3.4 10.91,30.61 10.78,30.48 v10.73,30.48 | U5.10 v19.49,22.48 | U4.1 v17.34,22.48 | U5.1 v25.34,22.35 | U$2.2 v33.85,16.76 | U4.19 16.7,18.03 16.45,18.29 v16.32,18.29 | C18.P$2 v7.05,25.15 | U4.10 10.78,23.95 v10.73,24 | U6.11 v8.83,15.37 | U6.12 9.48,15.6 v9.72,15.37 | C12.P$1 v2.35,26.29 | U6.13 9.48,23.77 v9.59,23.88 | C4.P$1 v18.22,14.35 | C17.P$2 26.7,16.2 v26.35,15.85
  Top 0.508: C2.P$1 v1.08,14.48 | C8.P$2 v28.26,20.95 | 3V3_REG2.2 C11.P$2 | C11.P$2 C25.P$2 v34.73,20.95 | C11.P$2 v33.59,20.95 | C26.P$2 v27.11,20.95
  Bottom 0.508: v1.71,12.19 1.59,12.06 U$1.GND 1.59,11.24 0.83,12 v0.83,12.19
  pour Route2: -1.27,42.55 40.01,42.55 40.01,-1.27 -1.27,-1.27
N$6
  Top 0.152: R20.P$1 9.69,37.62 S_LED10.A
N$9
  Top 0.152: U5.3 24.04,26.14 24.83,26.92 26.22,26.92 D3.C
N$10
  Top 0.152: X3.22 23.46,32.37 23.69,32.13 R23.P$2
N$11
  Top 0.203: X3.48 13.8,34.77 L1.P$2
N$12
  Top 0.203: R9.P$1 C23.P$1 13.4,37.47 15.31,35.57 X3.46
N$13
  Top 0.203: X3.44 16.84,37.33 R25.P$1 C24.P$1
QSPI_SCLK
  Top 0.152: X3.56 14.54,31.57 14.09,31.13 14.09,30.97 13.6,30.48 13.41,30.48 13.34,30.55 13.34,30.95 13.04,31.25 4.23,31.25 arc45 4.16,31.22 3.83,30.89 arc45 3.8,30.82 3.8,30.22 arc45 3.83,30.15 4,29.97 5.27,29.97 5.4,29.84 5.4,29.34 U3.6
QSPI_SD0
  Top 0.152: X3.57 14.72,31.17 13.41,29.86 10.25,29.86 arc-45 10.18,29.89 10,30.07 arc-45 9.97,30.14 9.97,30.57 arc45 9.94,30.64 9.84,30.73 9.72,30.73 9.62,30.64 arc45 9.59,30.57 9.59,30.23 9.46,30.1 9.34,30.1 9.21,30.23 9.21,30.61 9.08,30.73 8.95,30.73 8.83,30.61 8.83,30.23 8.7,30.1 8.57,30.1 8.45,30.23 8.45,30.61 8.32,30.73 8.19,30.73 8.06,30.61 8.06,30.23 7.94,30.1 7.81,30.1 7.68,30.23 7.68,30.61 7.56,30.73 7.43,30.73 7.3,30.61 7.3,30.23 7.18,30.1 7.05,30.1 6.92,30.23 6.92,30.61 6.79,30.73 6.67,30.73 6.54,30.61 6.54,30.23 6.41,30.1 6.29,30.1 5.78,30.61 U3.5
QSPI_SD1
  Top 0.152: U3.2 7.09,28.07 arc45 7.02,28.04 6.79,27.81 6.79,27.56 6.9,27.45 arc45 7.26,27.3 11.31,27.3 11.32,27.32 12.86,27.32 arc45 12.93,27.34 13.96,28.37 13.96,29.26 15.06,30.37 X3.59
QSPI_SD2
  Top 0.152: U3.3 9.59,29.34 9.21,29.72 6.92,29.72 6.67,29.46 6.67,29.08 7.05,28.7 13.4,28.7 13.65,28.96 13.65,29.46 14.95,30.77 X3.58
QSPI_SD3
  Top 0.152: U3.7 4.38,28.07 3.64,28.81 arc-45 3.49,29.16 3.49,31.07 arc-45 3.52,31.14 3.81,31.43 arc-45 4.16,31.58 13.99,31.58 14.35,31.94 arc-45 14.42,31.97 X3.55
QSPI_SS
  Top 0.152: X3.60 15.17,29.97 14.32,29.11 arc45 14.29,29.04 14.29,28.11 arc-45 14.26,28.04 13.43,27.21 arc45 13.4,27.14 13.4,26.33 arc-45 13.37,26.26 13.3,26.19 arc-45 13.23,26.16 7.43,26.16 7.3,26.29 7.3,26.8 7.43,26.92 12.05,26.92 U3.1
ROMRQ
  Top 0.152: U5.18 24.04,17.5 24.28,17.74 29.89,17.74 30.22,17.41 U$2.4
ROMRQ_3V3  (via drill 0.25)
  Top 0.152: v3.63,23.99 U6.22 3.62,22.54 v3.62,20.83 | v17.72,38.35 17.77,38.35 18.15,37.97 18.15,37 18.44,36.7 X3.40 | v24.07,22.35 24.12,22.35 24.7,22.94 U5.2
  Bottom 0.152: v3.63,23.99 4.03,24.38 4.71,24.38 8.39,28.07 8.39,37.34 9.34,38.28 17.64,38.28 v17.72,38.35 | v24.07,22.35 22.67,20.95 14.94,20.95 11.87,17.88 5.17,17.88 3.62,19.43 v3.62,20.83
RUN
  Top 0.152: X3.26 23.11,33.97 24.83,35.69 R24.P$1
SWCLK
  Top 0.152: X3.24 23.32,33.17 25.08,34.92 29.78,34.92 JP2.3
SWD
  Top 0.152: X3.25 23.21,33.57 24.88,35.23 31.36,35.23 JP2.2
USER_LED  (via drill 0.25)
  Top 0.152: X3.34 20.84,36.65 21.35,37.16 21.35,39.29 v21.27,39.37 | v9.84,39.37 R20.P$2
  Bottom 0.152: v21.27,39.37 21.27,39.24 20.77,38.73 18.48,38.73 18.22,38.99 17.34,38.99 17.08,38.73 10.35,38.73 9.84,39.24 v9.84,39.37
VCC  (via drill 0.25)
  Top 0.254: C2.P$2 1.11,16.82
  Top 0.356: 1.11,16.82 U6.1
  Top 0.508: 3V3_REG2.3 31.37,21.02 31.05,20.7 31.05,19.43 31.37,19.12 3V3_REG2.1 32.28,19.06 C11.P$1 C25.P$1 34.74,19.05 v35.62,19.05 | v1.08,17.78 C2.P$2
  Top 0.762: 37.15,11.94 v35.75,13.34 | U$1.5V 37.15,11.94 | 37.15,11.94 37.15,12.06 v37.78,12.7
  Bottom 0.508: v35.75,13.34 34.73,14.35 24.96,14.35 23.05,16.26 2.6,16.26 v1.08,17.78
  pour Route15: 34.61,50.8 34.61,31.75 30.8,27.94 30.8,-2.54 42.55,-2.54 42.55,50.8
XIN
  Top 0.152: X3.21 23.21,31.97 23.69,31.5 28,31.5 28.71,30.79 X2.1 28.71,29.04 C13.P$1
XOUT
  Top 0.152: R23.P$1 26.57,32.13 X2.3 27.11,34.03 C14.P$1

### Text on the board
tPlace: ACT | 3V3 | SWD | CLK | ZXR | GND | JLCJLCJLCJLC
bPlace: ZXelerator V1.0 / 2025 Smashcat